# Altium schematic sheet SFPextensionSplit.SchDoc
size A4
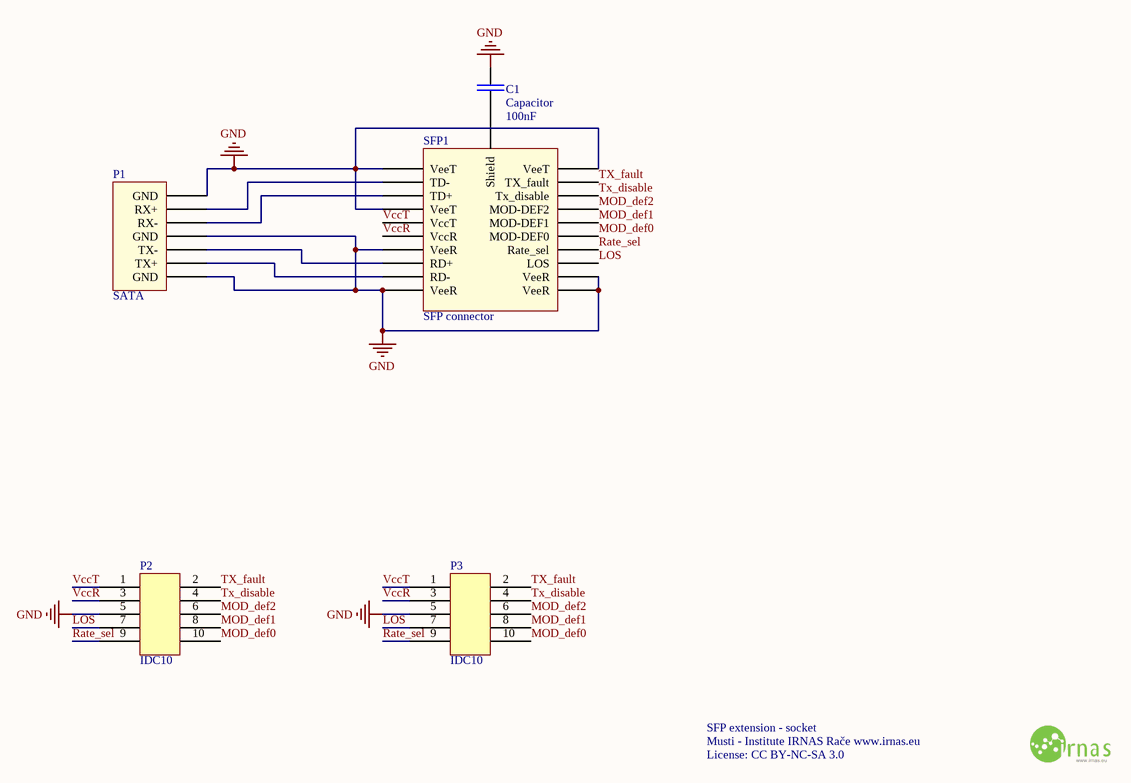
[diagram p0: SFPextensionSplit.SchDoc]

## Parts
C1  Capacitor  value 100nF  [RESC2012X06N]
P1  SATA  [SATA pcb]
P2  IDC10  [IDC10]
P3  IDC10  [IDC10]
SFP1  SFP connector  [SFP receptacle]

## Nets
GND: C1.1 P1.1(GND) P1.4(GND) P1.7(GND) P2.5 P3.5 SFP1.1(VeeT) SFP1.9(VeeR) SFP1.10(VeeR) SFP1.11(VeeR) SFP1.14(VeeR) SFP1.17(VeeT) SFP1.20(VeeT)
LOS: P2.7 P3.7 SFP1.8(LOS)
MOD_def0: P2.10 P3.10 SFP1.6(MOD-DEF0)
MOD_def1: P2.8 P3.8 SFP1.5(MOD-DEF1)
MOD_def2: P2.6 P3.6 SFP1.4(MOD-DEF2)
Rate_sel: P2.9 P3.9 SFP1.7(Rate_sel)
Tx_disable: P2.4 P3.4 SFP1.3(Tx_disable)
TX_fault: P2.2 P3.2 SFP1.2(TX_fault)
VccR: P2.3 P3.3 SFP1.15(VccR)
VccT: P2.1(A) P3.1(A) SFP1.16(VccT)
NetC1_2: C1.2 SFP1.21(Shield)
NetP1_2: P1.2(TX+) SFP1.12(RD-)
NetP1_3: P1.3(TX-) SFP1.13(RD+)
NetP1_5: P1.5(RX-) SFP1.18(TD+)
NetP1_6: P1.6(RX+) SFP1.19(TD-)

## Notes on the sheet
- SFP extension - socket
- Musti - Institute IRNAS Rače www.irnas.eu
- License: CC BY-NC-SA 3.0

## Library data of the parts
C1 = Capacitor: General capacitor
P2 P3 = IDC10: IDC 10pin